# EAGLE schematic untitled (EAGLE 6.2)
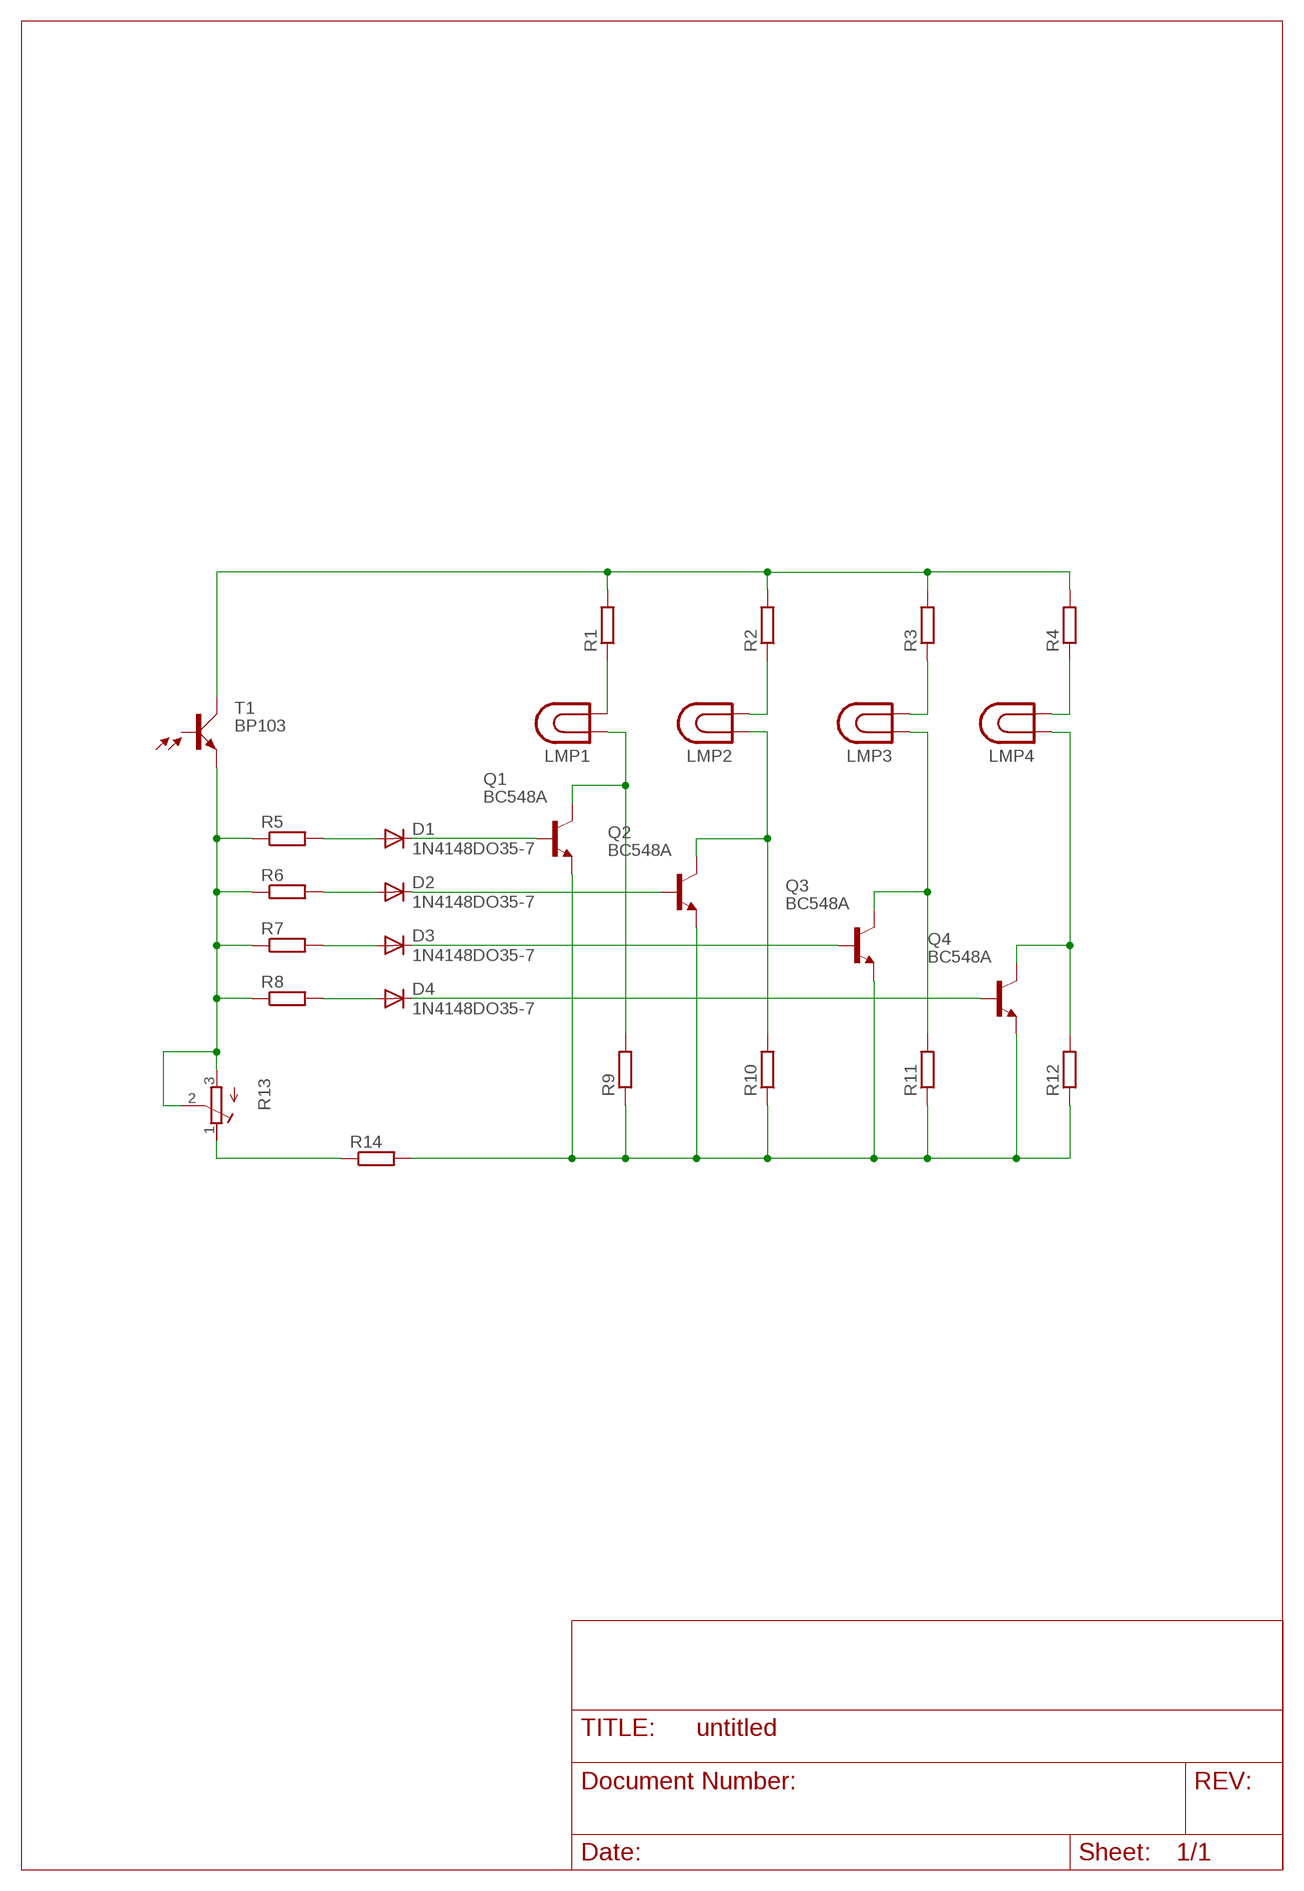
[diagram p0: schematic, sheet 1]

## Parts
D1  1N4148DO35-7  [DO35-7]
D2  1N4148DO35-7  [DO35-7]
D3  1N4148DO35-7  [DO35-7]
D4  1N4148DO35-7  [DO35-7]
LMP1  LAMP  [LDH-5R]
LMP2  LAMP  [LDH-5R]
LMP3  LAMP  [LDH-5R]
LMP4  LAMP  [LDH-5R]
Q1  BC548A  [TO92-EBC]
Q2  BC548A  [TO92-EBC]
Q3  BC548A  [TO92-EBC]
Q4  BC548A  [TO92-EBC]
R1  R-EU_0207/10  [0207/10]
R2  R-EU_0207/10  [0207/10]
R3  R-EU_0207/10  [0207/10]
R4  R-EU_0207/10  [0207/10]
R5  R-EU_0207/10  [0207/10]
R6  R-EU_0207/10  [0207/10]
R7  R-EU_0207/10  [0207/10]
R8  R-EU_0207/10  [0207/10]
R9  R-EU_0207/10  [0207/10]
R10  R-EU_0207/10  [0207/10]
R11  R-EU_0207/10  [0207/10]
R12  R-EU_0207/10  [0207/10]
R13  R-TRIMM43P  [RTRIM43P]
R14  R-EU_0207/10  [0207/10]
T1  BP103  [BP103]

## Nets
N$1: R5.1 R6.1 R7.1 R8.1 R13.2(S) R13.3(A) T1.E
N$2: D1.A R5.2
N$3: D2.A R6.2
N$4: D3.A R7.2
N$5: D4.A R8.2
N$6: R13.1(E) R14.1
N$7: D1.C Q1.B
N$8: Q1.E Q2.E Q3.E Q4.E R9.1 R10.1 R11.1 R12.1 R14.2
N$9: LMP1.1 Q1.C R9.2
N$10: LMP2.1 Q2.C R10.2
N$11: LMP1.2 R1.1
N$12: R1.2 R2.2 R3.2 R4.2 T1.C
N$13: LMP2.2 R2.1
N$14: D4.C Q4.B
N$15: D2.C Q2.B
N$17: D3.C Q3.B
N$18: LMP3.1 Q3.C R11.2
N$19: LMP4.1 Q4.C R12.2
N$20: LMP3.2 R3.1
N$22: LMP4.2 R4.1
Unconnected: T1.B

## Library data of the parts
D1-D4 = diode:1N4148: DIODE high speed (Philips)
LMP1-LMP4 = special:LAMP: LED HOLDER
Q1-Q4 = transistor-npn:BC548*: NPN Transistor
R1-R12 R14 = rcl:R-EU_: RESISTOR, European symbol
R13 = rcl:R-TRIMM: Trimm resistor
T1 = opto-trans-siemens:BP103: PHOTO TRANSISTOR; OC_FARNELL: unknown; OC_NEWARK: unknown